# Altium schematic sheet VDMEDA_7SegmentDriver.SchDoc
size A4
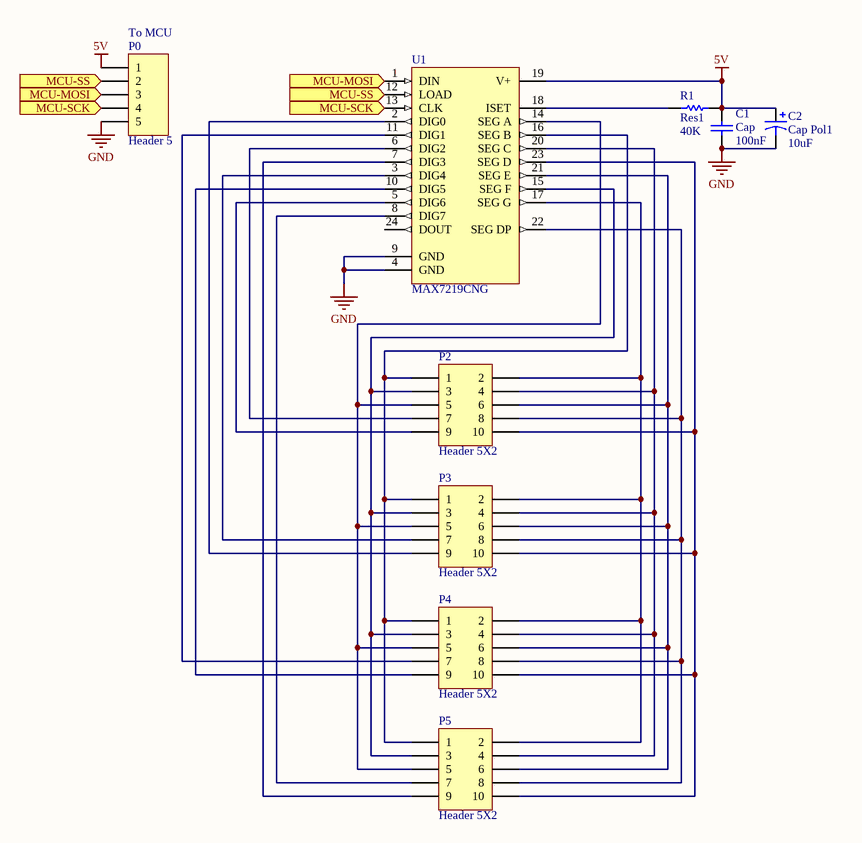
[diagram p0: VDMEDA_7SegmentDriver.SchDoc]

## Parts
C1  Cap  value 100nF  [RAD-0.2]
C2  Cap Pol1  value 10uF  [RB5-10.5]
P0  Header 5  [HDR1X5]
P2  Header 5X2  [HDR2X5]
P3  Header 5X2  [HDR2X5]
P4  Header 5X2  [HDR2X5]
P5  Header 5X2  [HDR2X5]
R1  Res1  value 40K  [AXIAL-0.3]
U1  MAX7219CNG  [NG24A]

## Ports
MCU-MOSI (out), MCU-SCK (out), MCU-SS (out)

## Nets
5V: C1.2 C2.1 P0.1 R1.2 U1.19(V+)
GND: C1.1 C2.2 P0.5 U1.4(GND) U1.9(GND)
MCU-MOSI: P0.3 U1.1(DIN) ; port MCU-MOSI
MCU-SCK: P0.4 U1.13(CLK) ; port MCU-SCK
MCU-SS: P0.2 U1.12(LOAD) ; port MCU-SS
NetP2_1: P2.1 P3.1 P4.1 P5.1 U1.16(SEG_B)
NetP2_2: P2.2 P3.2 P4.2 P5.2 U1.17(SEG_G)
NetP2_3: P2.3 P3.3 P4.3 P5.3 U1.15(SEG_F)
NetP2_4: P2.4 P3.4 P4.4 P5.4 U1.20(SEG_C)
NetP2_5: P2.5 P3.5 P4.5 P5.5 U1.14(SEG_A)
NetP2_6: P2.6 P3.6 P4.6 P5.6 U1.21(SEG_E)
NetP2_7: P2.7 U1.6(DIG2)
NetP2_8: P2.8 P3.8 P4.8 P5.8 U1.22(SEG_DP)
NetP2_9: P2.9 U1.5(DIG6)
NetP2_10: P2.10 P3.10 P4.10 P5.10 U1.23(SEG_D)
NetP3_7: P3.7 U1.3(DIG4)
NetP3_9: P3.9 U1.2(DIG0)
NetP4_7: P4.7 U1.11(DIG1)
NetP4_9: P4.9 U1.10(DIG5)
NetP5_7: P5.7 U1.8(DIG7)
NetP5_9: P5.9 U1.7(DIG3)
NetR1_1: R1.1 U1.18(ISET)

Not connected (* = marked no-connect by the designer): U1 24(DOUT)

## Notes on the sheet
- (near P0) To MCU

## Library data of the parts
C1 = Cap: Capacitor; Published: 8-Jun-2000; LatestRevisionDate: 17-Jul-2002; LatestRevisionNote: Re-released for DXP Platform.; PackageReference: RAD-0.3; Publisher: Altium Limited; PackageDescription: Radial Cap, Thru-Hole; 2 Leads; 0.3 in Pin Spacing
C2 = Cap Pol1: Polarized Capacitor (Radial); Published: 8-Jun-2000; LatestRevisionDate: 17-Jul-2002; LatestRevisionNote: Re-released for DXP Platform.; PackageReference: RB7.6-15; Publisher: Altium Limited; PackageDescription: Polarized Capacitor (Radial); 2 Leads
P0 = Header 5: Header, 5-Pin; LatestRevisionDate: 17-Jul-2002; LatestRevisionNote: Re-released for DXP Platform.; Publisher: Altium Limited
P2-P5 = Header 5X2: Header, 5-Pin, Dual row; LatestRevisionDate: 17-Jul-2002; LatestRevisionNote: Re-released for DXP Platform.; Publisher: Altium Limited
R1 = Res1: Resistor; Published: 8-Jun-2000; LatestRevisionDate: 17-Jul-2002; LatestRevisionNote: Re-released for DXP Platform.; PackageReference: AXIAL-0.3; Publisher: Altium Limited; PackageDescription: Axial Device, Thru-Hole; 2 Leads; 0.3 in Pin Spacing
U1 = MAX7219CNG: Serially Interfaced, 8-Digit LED Display Driver; Published: 16-Jan-2001; LatestRevisionDate: 29-May-2009; LatestRevisionNote: Component Body Added.; DatasheetVersion: Jul-1997; PackageVersion: 1997; PackageReference: NG24A; Publisher: Altium Limited; PackageDescription: DIP, 24-Pin, Row Spacing 7.62 mm, Pitch 2.54 mm; Code_JEDEC: MS-001-AF; ComponentLink1Description: Manufacturer Link; ComponentLink1URL: http://www.maxim-ic.com/; ComponentLink2Description: Datasheet; ComponentLink2URL: http://pdfserv.maxim-ic.com/en/ds/MAX7219-MAX7221.pdf